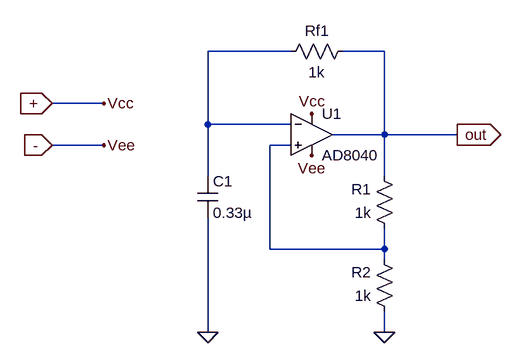
[diagram p0: schematic square-wave_generator.asc]
square-wave_generator.asc, the LTspice schematic file:
Version 4
SHEET 1 880 852
WIRE -320 -160 -448 -160
WIRE -176 -160 -240 -160
WIRE -608 -80 -688 -80
WIRE -448 -48 -448 -160
WIRE -320 -48 -448 -48
WIRE -176 -32 -176 -160
WIRE -176 -32 -256 -32
WIRE -64 -32 -176 -32
WIRE -608 -16 -688 -16
WIRE -320 -16 -352 -16
WIRE -448 32 -448 -48
WIRE -176 32 -176 -32
WIRE -352 144 -352 -16
WIRE -176 144 -176 112
WIRE -176 144 -352 144
WIRE -176 160 -176 144
WIRE -448 272 -448 96
WIRE -176 272 -176 240
FLAG -288 -64 Vcc
FLAG -448 272 0
FLAG -176 272 0
FLAG -64 -32 out
IOPIN -64 -32 Out
FLAG -288 0 Vee
FLAG -608 -80 Vcc
FLAG -608 -16 Vee
FLAG -688 -80 +
IOPIN -688 -80 In
FLAG -688 -16 -
IOPIN -688 -16 In
SYMBOL cap -464 32 R0
SYMATTR InstName C1
SYMATTR Value 0.33µ
SYMBOL res -224 -176 R90
WINDOW 0 0 56 VBottom 2
WINDOW 3 32 56 VTop 2
SYMATTR InstName Rf1
SYMATTR Value 1k
SYMBOL res -160 128 R180
WINDOW 0 36 76 Left 2
WINDOW 3 36 40 Left 2
SYMATTR InstName R1
SYMATTR Value 1k
SYMBOL res -160 256 R180
WINDOW 0 36 76 Left 2
WINDOW 3 36 40 Left 2
SYMATTR InstName R2
SYMATTR Value 1k
SYMBOL Opamps\\AD8040 -288 -96 R0
SYMATTR InstName U1

The netlist it stands for:
* square-wave_generator.asc
C1 N001 0 0.33µ
Rf1 out N001 1k
R1 N002 out 1k
R2 0 N002 1k
XU1 N002 N001 + - out AD8040  ; pins In+ In- V+ V- OUT
.backanno
.end